# Altium schematic sheet 10-Power.SchDoc
size A
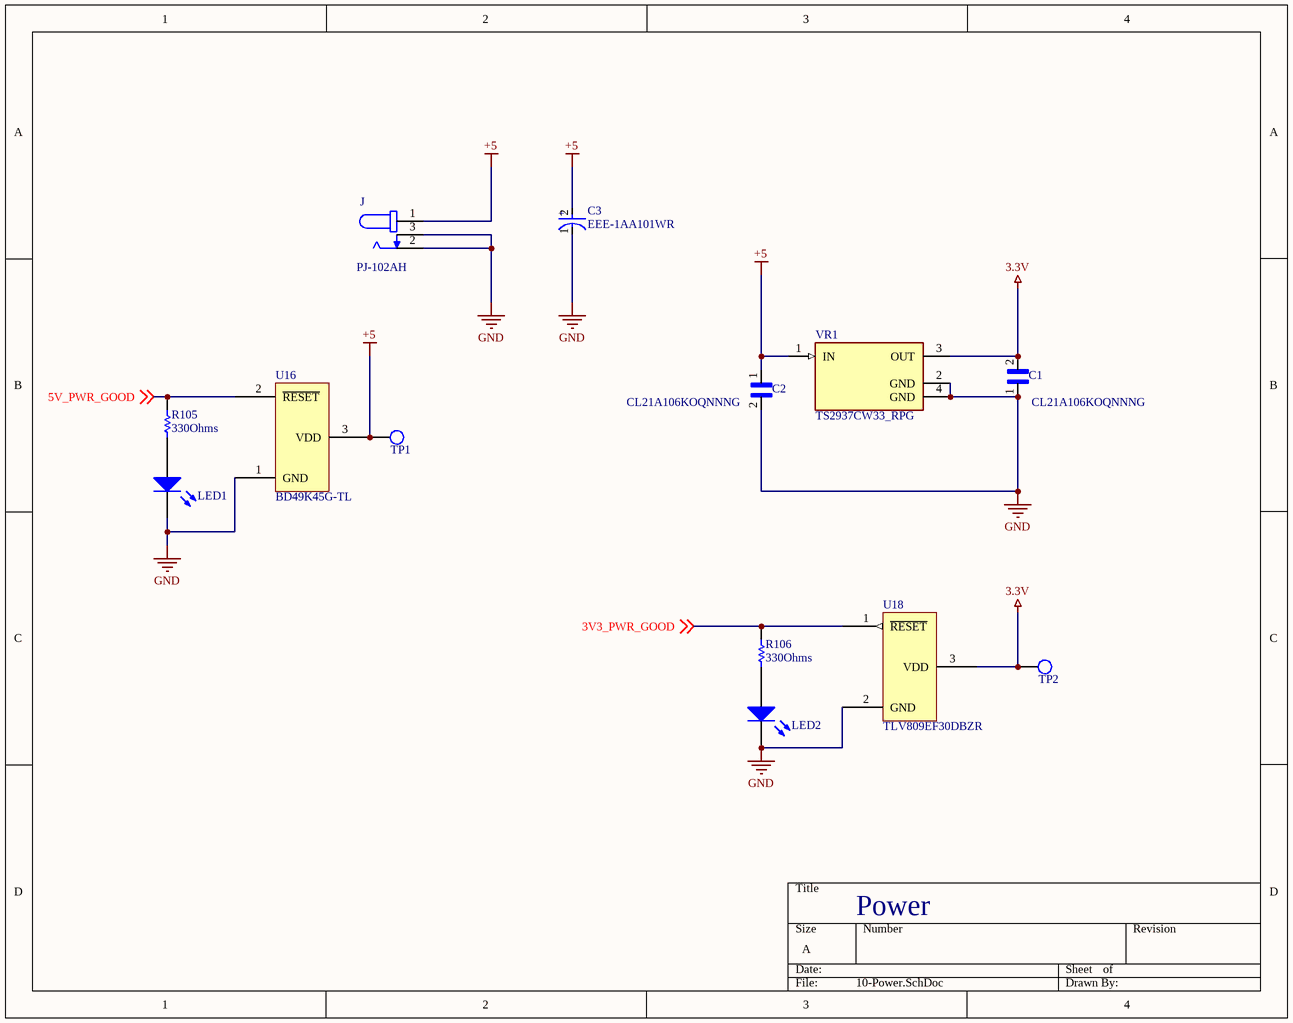
[diagram p0: 10-Power.SchDoc]

## Parts
C1  CL21A106KOQNNNG  [CAPC2012X140N]
C2  CL21A106KOQNNNG  [CAPC2012X140N]
C3  EEE-1AA101WR  [FP-SC-MFG]
J  PJ-102AH  [CUI_PJ-102AH]
LED1  150080RS75000  [0805_A]  (value not drawn)
LED2  150080RS75000  [0805_A]  (value not drawn)
R105  Resistance: 330Ohms  [RESC2013X60X35LL10T20]  (hidden comment: RC0805FR-07330RL)
R106  Resistance: 330Ohms  [RESC2013X60X35LL10T20]  (hidden comment: RC0805FR-07330RL)
TP1  TP_1206  [TP-SMC-1206]  (value not drawn)
TP2  TP_1206  [TP-SMC-1206]  (value not drawn)
U16  BD49K45G-TL  [SSOP3]
U18  TLV809EF30DBZR  [SOT95P237X112-3N]
VR1  TS2937CW33_RPG  [VREG_TS2937CW33_RPG]

## Nets
3.3V: C1.2 TP2.1 U18.3(VDD) VR1.3(OUT)
+5: C2.1 C3.2(A) J.1 TP1.1 U16.3(VDD) VR1.1(IN)
GND: C1.1 C2.2 C3.1(C) J.2 J.3 LED1.1(K) LED2.1(K) U16.1(GND) U18.2(GND) VR1.2(GND) VR1.4(GND)
3V3_PWR_GOOD: R106.2 U18.1(~{RESET}) ; off-sheet 3V3_PWR_GOOD
5V_PWR_GOOD: R105.2 U16.2(~{RESET}) ; off-sheet 5V_PWR_GOOD
NetLED1_2: LED1.2(A) R105.1
NetLED2_2: LED2.2(A) R106.1

## Notes on the sheet
- Power
- (in symbol CMP-05427-000047-1) +

## Library data of the parts
C1 C2 = CL21A106KOQNNNG: 10ÂµF Â±10% 16V Ceramic Capacitor X5R 0805 _2012 Metric_; MF: Samsung Electro-Mechanics; Package: 0805 Samsung; Digi-Key_Part_Number: 1276-6455-1-ND; Digi-Key_Purchase_URL: https://www.digikey.com/product-detail/en/samsung-electro-mechanics/CL21A106KOQNNNG/1276-6455-1-ND/5958083?utm_source=snapeda&utm_medium=aggregator&utm_campaign=symbol; Value: *; MP: CL21A106KOQNNNG; SnapEDA_Link: https://www.snapeda.com/parts/CL21A106KOQNNNG/Samsung%20Electro-Mechanics/view-part/3597829/?ref=snap
C3 = CMP-05427-000047-1: CAP ALUM 100UF 20% 10V SMD; Life (Hours): 1000Hour; Ripple Current: 50mA; Packaging: Tape and Reel; Diameter: 5mm; Voltage Rating (DC): 10V; Mount: Surface Mount; Max Operating Temperature: 85°C; Length: 5.5mm; Case/Package: Radial; Height: 5.4mm; Construction: Cylindrical; Termination: SMD/SMT; Height - Seated (Max): 0.213inch; Series: S; Min Operating Temperature: -40°C; Capacitance: 100uF; Tolerance: 20%; Voltage Rating: 10V; Package Quantity: 1; Radiation Hardening: No; Ripple Current (AC): 50mA; Lead Free: Lead Free; RoHS Compliant: Yes; Contact Plating: Tin
J = PJ-102AH: 2.0 x 6.5 mm, 5.0 A, Horizontal, Through Hole, Tapered Pins, Dc Power Jack Connector; MF: CUI Devices; Digi-Key_Part_Number: CP-102AH-ND; CUI_purchase_URL: https://www.cuidevices.com/product/interconnect/connectors/dc-power-connectors/jacks/pj-102ah?utm_source=snapeda.com&utm_medium=referral&utm_campaign=snapedaBOM; SnapEDA_Link: https://www.snapeda.com/parts/PJ-102AH/CUI%20Devices/view-part/228264/?ref=snap; Package: None; Value: *; Digi-Key_Purchase_URL: https://www.digikey.com/product-detail/en/cui-devices/PJ-102AH/CP-102AH-ND/408448?utm_source=snapeda&utm_medium=aggregator&utm_campaign=symbol; MP: PJ-102AH
LED1 LED2 = CMP-1426-00011-1: SMD mono-color Chip LED, WL-SMCW, Red; Manufacturer: Wuerth Elektronik; Color: Red; PartNumber: 150080RS75000; PackageReference: 0805_A; ComponentLink2Description: Datasheet; ComponentLink1URL: http://www.we-online.com; ComponentLink1Description: Manufacturer URL; ComponentLink2URL: http://katalog.we-online.com/led/datasheet/150080RS75000.pdf
R105 R106 = CMP-2000-06960-1: Chip Resistor, 330 Ohm, +/- 1%, 125 mW, -55 to 155 degC, 0805 (2012 Metric), RoHS, Tape and Reel; Manufacturer: Yageo; Voltage Rating: 150V; Temperature Coefficient: 100PPM/C; Power Rating: 125mW(1/8W); Datasheet Version: Rev. 7, 05/2017; Termination Style: SMD/SMT; Case Code - mm: 2012; Package Description: 2-Pin Surface Mounted Device, Body 2 x 1.25 mm; Operating Temperature Range: -55Cto+155C; Case Code - in: 0805; Packaging: Reel; Tolerance: 1%; Package Reference: 0805; Mounting Technology: SurfaceMount; Product: ThickFilmResistorsGeneralPurpose; Series: RC; Manufacturer URL: http://www.yageo.com/; Datasheet URL: http://www.yageo.com/documents/recent/PYu-RC_Group_51_RoHS_L_7.pdf
TP1 TP2 = TP_1206: Test Point SMD 1206; Manufacturer: TE Connectivity (Tyco Electronics); Manufacturer Part Number: 1625854-1; Resistance Value: 0 Ohm; Temperature Coefficient: N/R; Supplier: Digi-Key; Stock 1: 31937; Pricing 1: 1=0.28, 10=0.261, 25=0.224, 50=0.1902, 100=0.1828, 250=0.1641, 500=0.1567, 1000=0.1306 (USD); Case Size: 1206; Dimension: 3.2 x 1.6 x 1.25mm; Family: RC; Mounting: Surface Mount; Operating Temperature: -55 to 125 C; Part No: 1625854-1; RoHS: Yes; Packaging: Tape and Reel; Termination Style: N/R; Terminal Pitch: N/R; Power Rating: N/R; Tolerance: N/R; ComponentLink1URL: https://datasheet.ciiva.com/6439/eng-ds-1773266-a-6439169.pdf; ComponentLink1Description: https://datasheet.ciiva.com/6439/eng-ds-1773266-a-6439169.pdf; ComponentLink2URL: https://datasheet.ciiva.com/30136/1773266-a-30136341.pdf; ComponentLink2Description: https://datasheet.ciiva.com/30136/1773266-a-30136341.pdf; ComponentLink3URL: https://datasheet.ciiva.com/6439/eng-ds-1773266-a-6439080.pdf; ComponentLink3Description: https://datasheet.ciiva.com/6439/eng-ds-1773266-a-6439080.pdf; ComponentLink4URL: https://datasheet.ciiva.com/6439/eng-ds-1773266-a-6439081.pdf; ComponentLink4Description: https://datasheet.ciiva.com/6439/eng-ds-1773266-a-6439081.pdf; ComponentLink5URL: https://datasheet.ciiva.com/6439/eng-ds-1773266-a-6439083.pdf; ComponentLink5Description: https://datasheet.ciiva.com/6439/eng-ds-1773266-a-6439083.pdf; Supplier Part Number: A106143CT-ND
VR1 = TS2937CW33_RPG: MP: TS2937CW33_RPG; Value: *; Availability: Unavailable; Package: None; Price: None